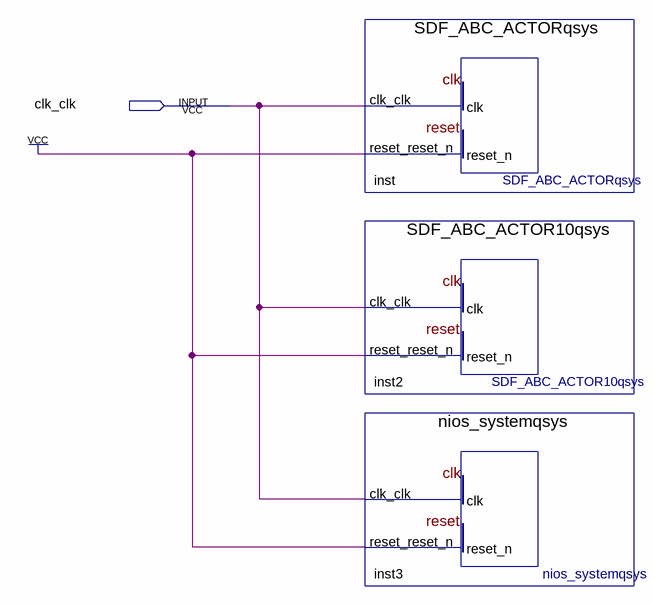
[diagram p0: schematic sheet]
// Quartus schematic FB_SDF.bdf as structural Verilog: 3 symbols, 1 pins
module FB_SDF (
  input  clk_clk
);

  SDF_ABC_ACTORqsys inst (.clk_clk(clk_clk), .reset_reset_n(1'b1));
  SDF_ABC_ACTOR10qsys inst2 (.clk_clk(clk_clk), .reset_reset_n(1'b1));
  nios_systemqsys inst3 (.clk_clk(clk_clk), .reset_reset_n(1'b1));
endmodule
